# Altium schematic sheet connectors.SchDoc: Connectors
size A4; Organization: Badgerloop Electrical; Address1: 133 Engineering Research Building; Address2: 1500 Engineering Drive; Address3: Madison, Wi 53706; SheetNumber: 2
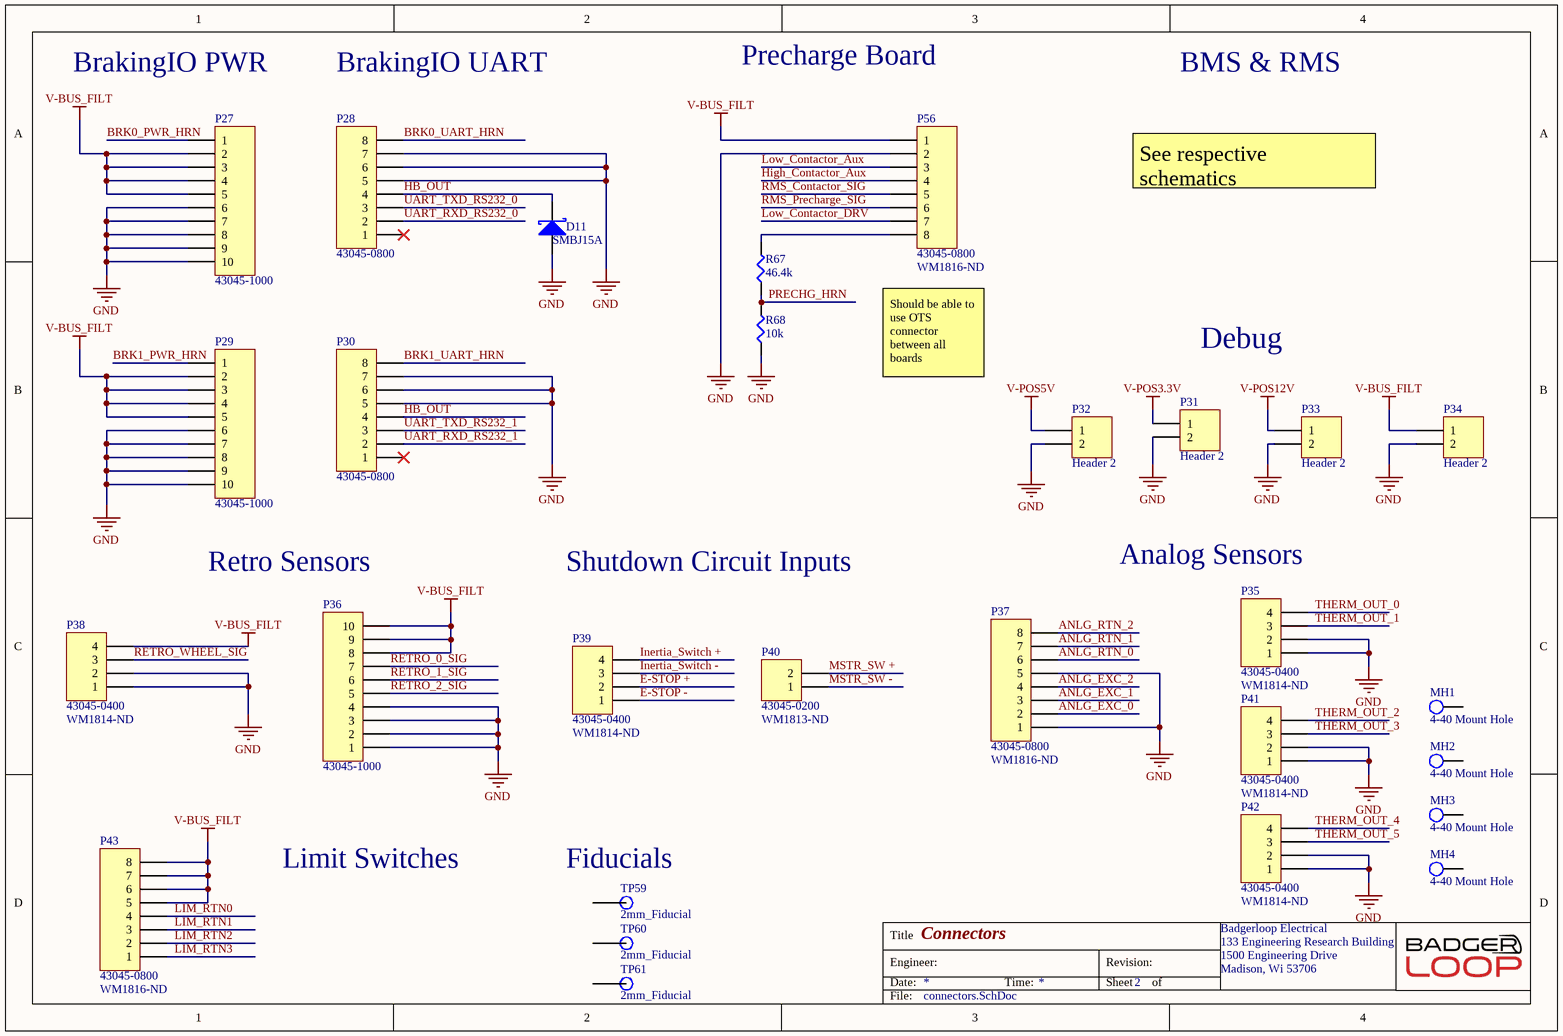
[diagram p0: connectors.SchDoc]

## Parts
D11  SMBJ15A  [DIOM4436X26N]
MH1  4-40 Mount Hole  [MH]
MH2  4-40 Mount Hole  [MH]
MH3  4-40 Mount Hole  [MH]
MH4  4-40 Mount Hole  [MH]
P27  43045-1000  [430451000]
P28  43045-0800  [430450800]
P29  43045-1000  [430451000]
P30  43045-0800  [430450800]
P31  Header 2  [Pin Header 1x2 TH Pitch 2.54mm]
P32  Header 2  [Pin Header 1x2 TH Pitch 2.54mm]
P33  Header 2  [Pin Header 1x2 TH Pitch 2.54mm]
P34  Header 2  [Pin Header 1x2 TH Pitch 2.54mm]
P35  43045-0400  Supplier Part Number 1: WM1814-ND  [430450400]
P36  43045-1000  [430451000]
P37  43045-0800  Supplier Part Number 1: WM1816-ND  [430450800]
P38  43045-0400  Supplier Part Number 1: WM1814-ND  [430450400]
P39  43045-0400  Supplier Part Number 1: WM1814-ND  [430450400]
P40  43045-0200  Supplier Part Number 1: WM1813-ND  [430450200]
P41  43045-0400  Supplier Part Number 1: WM1814-ND  [430450400]
P42  43045-0400  Supplier Part Number 1: WM1814-ND  [430450400]
P43  43045-0800  Supplier Part Number 1: WM1816-ND  [430450800]
P56  43045-0800  Supplier Part Number 1: WM1816-ND  [430450800]
R67  46.4k  [SMD-1206-RES]
R68  10k  [SMD-0805-RES]
TP59  2mm_Fiducial  [2mm_Fiducial]
TP60  2mm_Fiducial  [2mm_Fiducial]
TP61  2mm_Fiducial  [2mm_Fiducial]

## Nets
GND: D11.2(K) P27.6 P27.7 P27.8 P27.9 P27.10 P28.5 P28.6 P28.7 P29.6 P29.7 P29.8 P29.9 P29.10 P30.5 P30.6 P30.7 P31.2 P32.2 P33.2 P34.2 P35.1 P35.2 P36.1 P36.2 P36.3 P36.4 P37.1 P37.5 P38.1 P38.2 P41.1 P41.2 P42.1 P42.2 P56.2 R68.1
V-BUS_FILT: P27.2 P27.3 P27.4 P27.5 P29.2 P29.3 P29.4 P29.5 P34.1 P36.8 P36.9 P36.10 P38.4 P43.5 P43.6 P43.7 P43.8 P56.1
V-POS3.3V: P31.1
V-POS5V: P32.1
V-POS12V: P33.1
ANLG_EXC_0: P37.2
ANLG_EXC_1: P37.3
ANLG_EXC_2: P37.4
ANLG_RTN_0: P37.6
ANLG_RTN_1: P37.7
ANLG_RTN_2: P37.8
BRK0_PWR_HRN: P27.1
BRK0_UART_HRN: P28.8
BRK1_PWR_HRN: P29.1
BRK1_UART_HRN: P30.8
E-STOP +: P39.2
E-STOP -: P39.1
HB_OUT: D11.1(A) P28.4 P30.4
High_Contactor_Aux: P56.4
Inertia_Switch +: P39.4
Inertia_Switch -: P39.3
LIM_RTN0: P43.4
LIM_RTN1: P43.3
LIM_RTN2: P43.2
LIM_RTN3: P43.1
Low_Contactor_Aux: P56.3
Low_Contactor_DRV: P56.7
MSTR_SW +: P40.2
MSTR_SW -: P40.1
PRECHG_HRN: R67.1 R68.2
RETRO_0_SIG: P36.7
RETRO_1_SIG: P36.6
RETRO_2_SIG: P36.5
RETRO_WHEEL_SIG: P38.3
RMS_Contactor_SIG: P56.5
RMS_Precharge_SIG: P56.6
THERM_OUT_0: P35.4
THERM_OUT_1: P35.3
THERM_OUT_2: P41.4
THERM_OUT_3: P41.3
THERM_OUT_4: P42.4
THERM_OUT_5: P42.3
UART_RXD_RS232_0: P28.2
UART_RXD_RS232_1: P30.2
UART_TXD_RS232_0: P28.3
UART_TXD_RS232_1: P30.3
NetP56_8: P56.8 R67.2

Not connected (* = marked no-connect by the designer): MH1 46; MH2 46; MH3 46; MH4 46; P28 1*; P30 1*; TP59 1; TP60 1; TP61 1

## Notes on the sheet
- BrakingIO PWR
- BrakingIO UART
- Precharge Board
- BMS & RMS
- See respective schematics
- Should be able to use OTS connector between all boards
- Debug
- Retro Sensors
- Shutdown Circuit Inputs
- (near P35) Analog Sensors
- Limit Switches
- (near TP59) Fiducials
- Title
- Engineer:
- Date:
- Time:
- Revision:
- Sheet
- of
- File:

## Library data of the parts
D11 = SMBJ15A: TVS DIODE 15V 24.4V DO214AA; Manufacturer: Littelfuse; Direction: Unidirectional; Min Breakdown Voltage: 16.7V; Peak Pulse Power: 600W; Peak Pulse Current: 24.6A; Test Current: 1mA; Number of Elements: 1; Power Line Protection: No; Max Breakdown Voltage: 18.5V; Max Reverse Leakage Current: 1uA; Max Power Dissipation: 5W; Element Configuration: Single; ESD Protection: Yes; Current: 68A; Voltage: 5V; Supplier 1: Digi-Key; Stock 1: 73945; Pricing 1: 1=0.45000, 10=0.33900, 25=0.30520, 100=0.21090, 250=0.17760, 500=0.14430, 1000=0.11100 (USD); RoHS: Yes; Mount: Surface Mount; Case/Package: SMB; Number of Pins: 2; Min Operating Temperature: -65°C; Max Operating Temperature: 150°C; Packaging: Tape and Reel; Reverse Standoff Voltage: 15V; Clamping Voltage: 24.4V; Power Dissipation: 600W; Voltage Rating (DC): 15V; Reverse Breakdown Voltage: 16.7V; Package Quantity: 3000; Operating Supply Voltage: 15V; Max Surge Current: 24.6A; Number of Unidirectional Channels: 1; Breakdown Voltage: 16.7V; Number of Channels: 1; Polarity: Unidirectional; Termination: SMD/SMT; Leakage Current: 1uA; Composition: Zener; Length: 4.57mm; Height: 2.237mm; Width: 3.94mm; Radiation Hardening: No; Lead Free: Lead Free; REACH SVHC: Unknown; ComponentLink1URL: https://datasheet.ciiva.com/34301/1078555-34301957.pdf?src-supplier=Jameco; ComponentLink1Description: https://datasheet.ciiva.com/34301/1078555-34301957.pdf?src-supplier=Jameco; ComponentLink2URL: https://datasheet.ciiva.com/25624/0900766b810f4eeb-25624826.pdf?src-supplier=RSComponents; ComponentLink2Description: https://datasheet.ciiva.com/25624/0900766b810f4eeb-25624826.pdf?src-supplier=RSComponents; ComponentLink3URL: https://datasheet.ciiva.com/46385/13057-46385079.pdf?src-supplier=Element14; ComponentLink3Description: https://datasheet.ciiva.com/46385/13057-46385079.pdf?src-supplier=Element14; ComponentLink4URL: https://datasheet.ciiva.com/331/littelfuse-tvs-diode-smbj-datasheet-pdf-331176.pdf?src-supplier=Digi-Key; ComponentLink4Description: https://datasheet.ciiva.com/331/littelfuse-tvs-diode-smbj-datasheet-pdf-331176.pdf?src-supplier=Digi-Key; ComponentLink5URL: https://datasheet.ciiva.com/331/littelfuse-tvs-diode-smbj-datasheet-pdf-331177.pdf?src-supplier=Digi-Key; ComponentLink5Description: https://datasheet.ciiva.com/331/littelfuse-tvs-diode-smbj-datasheet-pdf-331177.pdf?src-supplier=Digi-Key; ComponentLink6URL: https://datasheet.ciiva.com/331/littelfuse-tvs-diode-smbj-datasheet-pdf-331178.pdf?src-supplier=Digi-Key; ComponentLink6Description: https://datasheet.ciiva.com/331/littelfuse-tvs-diode-smbj-datasheet-pdf-331178.pdf?src-supplier=Digi-Key; Supplier 2: Digi-Key; Stock 2: 69911; Pricing 2: 1=0.35000, 10=0.28700, 25=0.26240, 100=0.19540, 250=0.17704, 500=0.14652, 1000=0.10989 (USD); ComponentLink7URL: https://datasheet.ciiva.com/25624/0900766b810f4eeb-25624712.pdf?src-supplier=RSComponents; ComponentLink7Description: https://datasheet.ciiva.com/25624/0900766b810f4eeb-25624712.pdf?src-supplier=RSComponents; ComponentLink8URL: https://datasheet.ciiva.com/34302/1546929-34302459.pdf?src-supplier=Jameco; ComponentLink8Description: https://datasheet.ciiva.com/34302/1546929-34302459.pdf?src-supplier=Jameco; ComponentLink9URL: https://datasheet.ciiva.com/46381/1677318-46381958.pdf?src-supplier=Element14; ComponentLink9Description: https://datasheet.ciiva.com/46381/1677318-46381958.pdf?src-supplier=Element14; ComponentLink10URL: https://datasheet.ciiva.com/331/littelfuse-tvs-diode-smbj-datasheet-pdf-331131.pdf?src-supplier=Digi-Key; ComponentLink10Description: https://datasheet.ciiva.com/331/littelfuse-tvs-diode-smbj-datasheet-pdf-331131.pdf?src-supplier=Digi-Key; ComponentLink11URL: https://datasheet.ciiva.com/331/littelfuse-tvs-diode-smbj-datasheet-pdf-331132.pdf?src-supplier=Digi-Key; ComponentLink11Description: https://datasheet.ciiva.com/331/littelfuse-tvs-diode-smbj-datasheet-pdf-331132.pdf?src-supplier=Digi-Key; ComponentLink12URL: https://datasheet.ciiva.com/331/littelfuse-tvs-diode-smbj-datasheet-pdf-331133.pdf?src-supplier=Digi-Key; ComponentLink12Description: https://datasheet.ciiva.com/331/littelfuse-tvs-diode-smbj-datasheet-pdf-331133.pdf?src-supplier=Digi-Key; Supplier Part Number 2: SMBJ5.0ALFCT-ND; Supplier Part Number 1: SMBJ15ALFCT-ND
P27 P29 P36 = 43045-1000: GLOVE, POLYAMIDE, L/FREE, PU, SIZE 6 - More Details; Manufacturer: Molex; Connector Type: Power,Rectangular; Number of Positions: 10; Contact Resistance: 10mR; Gender: Male; Current Rating: 5A; Voltage Rating: 250V; Max Voltage Rating (DC): 250.25kV; Insulation Resistance: 1GR; Pitch: 3mm; Approvals: UL,CSA,TUV; Glow Wire Compliant: Compliant; Supplier 1: Digi-Key; Manufacturer Part Number: 43045-1000; Stock 1: 4799; Pricing 1: 1=2.57000, 10=2.33100, 100=1.99790, 500=1.66496, 1000=1.42710, 5000=1.26536 (USD); RoHS: Yes; Mount: Through Hole,PCB; Contact Plating: Tin; Color: Black; Contact Material: Brass,Tin; Housing Color: Black; Housing Material: Thermoplastic; Material: Polyester; Min Operating Temperature: -40°C; Max Operating Temperature: 105°C; Number of Rows: 2; Termination: Solder; Packaging: Tray; Number of Contacts: 10; Package Quantity: 1224; Orientation: Right Angle; Max Current Rating: 5A; Number of Poles: 10; Voltage Rating (AC): 250V; Number of Circuits: 10; Working Voltage: 250V; Voltage Rating (DC): 250V; Diameter: 3mm; Length: 19.15mm; Height: 8.77mm; Row Spacing: 3mm; Depth: 12.2mm; Radiation Hardening: No; Lead Free: Lead Free; Flammability Rating: UL94 V-0; REACH SVHC: Unknown; Halogen Free: Low Halogen; ComponentLink1URL: https://datasheet.ciiva.com/5150/0430451000-pcb-headers-143006-5150145.pdf?src-supplier=Mouser; ComponentLink1Description: https://datasheet.ciiva.com/5150/0430451000-pcb-headers-143006-5150145.pdf?src-supplier=Mouser; ComponentLink2URL: https://datasheet.ciiva.com/11749/0900766b80027348-11749233.pdf?src-supplier=RSComponents; ComponentLink2Description: https://datasheet.ciiva.com/11749/0900766b80027348-11749233.pdf?src-supplier=RSComponents; ComponentLink3URL: https://datasheet.ciiva.com/19461/883595-19461109.pdf?src-supplier=Jameco; ComponentLink3Description: https://datasheet.ciiva.com/19461/883595-19461109.pdf?src-supplier=Jameco; ComponentLink4URL: https://datasheet.ciiva.com/30068/153980430451000-pcb-headers-30068060.pdf?src-supplier=Onlinecomponents.com; ComponentLink4Description: https://datasheet.ciiva.com/30068/153980430451000-pcb-headers-30068060.pdf?src-supplier=Onlinecomponents.com; ComponentLink5URL: https://datasheet.ciiva.com/14155/04402310-14155207.pdf?src-supplier=Distrelec; ComponentLink5Description: https://datasheet.ciiva.com/14155/04402310-14155207.pdf?src-supplier=Distrelec; ComponentLink6URL: https://datasheet.ciiva.com/18454/70090797-18454139.pdf?src-supplier=Allied+Electronics; ComponentLink6Description: https://datasheet.ciiva.com/18454/70090797-18454139.pdf?src-supplier=Allied+Electronics; ComponentLink7URL: https://datasheet.ciiva.com/16658/0430451000-pcb-headers-16658413.pdf?src-supplier=Avnet+Europe; ComponentLink7Description: https://datasheet.ciiva.com/16658/0430451000-pcb-headers-16658413.pdf?src-supplier=Avnet+Europe; ComponentLink8URL: https://datasheet.ciiva.com/9468/0430451000-pcb-headers-9468495.pdf?src-supplier=Avnet; ComponentLink8Description: https://datasheet.ciiva.com/9468/0430451000-pcb-headers-9468495.pdf?src-supplier=Avnet; Supplier Part Number 1: WM1817-ND
P28 P30 P37 P43 P56 = 43045-0800: CONN HEADER R/A 8POS 3MM; Manufacturer: Molex; Number of Contacts: 8; Contact Resistance: 10mR; Max Voltage Rating (DC): 250.25kV; Current Rating: 5A; Voltage Rating (AC): 250V; Voltage Rating: 600V; Gender: Male; Insulation Resistance: 1GR; Approvals: UL,CSA,TUV; Glow Wire Compliant: Compliant; Supplier 1: Digi-Key; Manufacturer Part Number: 43045-0800; Stock 1: 2632; Pricing 1: 1=1.91000, 10=1.73100, 100=1.48390, 500=1.23656, 1000=1.05990, 5000=0.93978, 10000=0.91858 (USD); RoHS: Yes; Mount: Through Hole; Case/Package: SMC; Contact Plating: Tin; Contact Material: Brass,Tin; Color: Black; Housing Color: Black; Housing Material: Thermoplastic; Material: Polyester; Min Operating Temperature: -40°C; Max Operating Temperature: 105°C; Number of Rows: 2; Termination: Solder; Packaging: Tray; Number of Positions: 8; Orientation: Right Angle; Number of Poles: 8; Package Quantity: 1440; Max Current Rating: 5A; Number of Circuits: 8; Working Voltage: 250V; Voltage Rating (DC): 250V; Diameter: 3mm; Length: 16.15mm; Height: 8.77mm; Pitch: 3mm; Row Spacing: 3mm; Depth: 12.2mm; Radiation Hardening: No; Flammability Rating: UL94 V-0; REACH SVHC: Unknown; Halogen Free: Low Halogen; Lead Free: Lead Free; ComponentLink1URL: https://datasheet.ciiva.com/5158/0430450800-pcb-headers-142625-5158817.pdf?src-supplier=Mouser; ComponentLink1Description: https://datasheet.ciiva.com/5158/0430450800-pcb-headers-142625-5158817.pdf?src-supplier=Mouser; ComponentLink2URL: https://datasheet.ciiva.com/7683/27645-7683683.pdf?src-supplier=Element14; ComponentLink2Description: https://datasheet.ciiva.com/7683/27645-7683683.pdf?src-supplier=Element14; ComponentLink3URL: https://datasheet.ciiva.com/19462/883536-19462164.pdf?src-supplier=Jameco; ComponentLink3Description: https://datasheet.ciiva.com/19462/883536-19462164.pdf?src-supplier=Jameco; ComponentLink4URL: https://datasheet.ciiva.com/11751/0900766b80027348-11751142.pdf?src-supplier=RSComponents; ComponentLink4Description: https://datasheet.ciiva.com/11751/0900766b80027348-11751142.pdf?src-supplier=RSComponents; ComponentLink5URL: https://datasheet.ciiva.com/30198/267770430450800-pcb-headers-30198875.pdf?src-supplier=Onlinecomponents.com; ComponentLink5Description: https://datasheet.ciiva.com/30198/267770430450800-pcb-headers-30198875.pdf?src-supplier=Onlinecomponents.com; ComponentLink6URL: https://datasheet.ciiva.com/1443/1850016-1443537.pdf?src-supplier=Element14; ComponentLink6Description: https://datasheet.ciiva.com/1443/1850016-1443537.pdf?src-supplier=Element14; ComponentLink7URL: https://datasheet.ciiva.com/14155/04402310-14155206.pdf?src-supplier=Distrelec; ComponentLink7Description: https://datasheet.ciiva.com/14155/04402310-14155206.pdf?src-supplier=Distrelec; ComponentLink8URL: https://datasheet.ciiva.com/16657/0430450800-pcb-headers-16657964.pdf?src-supplier=Avnet+Europe; ComponentLink8Description: https://datasheet.ciiva.com/16657/0430450800-pcb-headers-16657964.pdf?src-supplier=Avnet+Europe; ComponentLink9URL: https://datasheet.ciiva.com/10087/0430450800-pcb-headers-10087853.pdf?src-supplier=Avnet; ComponentLink9Description: https://datasheet.ciiva.com/10087/0430450800-pcb-headers-10087853.pdf?src-supplier=Avnet
  P28 P30: Supplier Part Number 1: WM1816-ND
P31-P34 = Header 2: Header, 2-Pin; LatestRevisionDate: 17-Jul-2002; LatestRevisionNote: Re-released for DXP Platform.; Publisher: Altium Limited
P35 P38 P39 P41 P42 = 43045-0400: Male connector dual row 90° 3 mm Pole no. 2x2 Micro-Fit, 43045-0400, Molex; Contact Resistance: 10mR; Number of Contacts: 4; Max Voltage Rating (AC): 250V; Connector Type: Male Pin; Pitch: 3mm; Row Spacing: 0.118inch; Supplier 1: Digi-Key; Manufacturer: Molex; Manufacturer Part Number: 43045-0400; Stock 1: 5904; Pricing 1: 1=1.33000, 10=1.16700, 100=1.00670, 500=0.82368, 1000=0.73216, 5000=0.64064, 10000=0.60861 (USD); RoHS: Yes; Mount: Through Hole; Contact Plating: Tin; Color: Black; Contact Material: Brass; Housing Color: Black; Housing Material: Polymer; Min Operating Temperature: -40°C; Max Operating Temperature: 105°C; Number of Rows: 2; Termination: Solder; Packaging: Tray; Fastening Type: Ramp; Number of Positions: 4; Orientation: Right Angle; Length: 10.15mm; Depth: 12.2mm; Flammability Rating: UL94 V-0; ComponentLink1URL: https://datasheet.ciiva.com/712/430450200-sd-712017.pdf?src-supplier=Digi-Key; ComponentLink1Description: https://datasheet.ciiva.com/712/430450200-sd-712017.pdf?src-supplier=Digi-Key; ComponentLink2URL: https://datasheet.ciiva.com/20209/22-3744e-20209522.pdf?src-supplier=Rapid+Electronics; ComponentLink2Description: https://datasheet.ciiva.com/20209/22-3744e-20209522.pdf?src-supplier=Rapid+Electronics; ComponentLink3URL: https://datasheet.ciiva.com/11746/0900766b80027348-11746988.pdf?src-supplier=RSComponents; ComponentLink3Description: https://datasheet.ciiva.com/11746/0900766b80027348-11746988.pdf?src-supplier=RSComponents; ComponentLink4URL: https://datasheet.ciiva.com/30193/145420430450400-pcb-headers-30193310.pdf?src-supplier=Onlinecomponents.com; ComponentLink4Description: https://datasheet.ciiva.com/30193/145420430450400-pcb-headers-30193310.pdf?src-supplier=Onlinecomponents.com
P40 = 43045-0200: CONN HEADER R/A 2POS; Manufacturer: Molex; Contact Resistance: 10mR; Number of Contacts: 2; Voltage Rating: 600V; Current Rating: 5A; Gender: Male; Max Voltage Rating (DC): 250.25kV; Voltage Rating (DC): 250V; Insulation Resistance: 1GR; Pitch: 3mm; Glow Wire Compliant: Compliant; Approvals: UL,CSA,TUV; Supplier 1: Digi-Key; Manufacturer Part Number: 43045-0200; Stock 1: 6320; Pricing 1: 1=0.97000, 10=0.84900, 100=0.73280, 500=0.59958, 1000=0.53296, 5000=0.46634, 10000=0.44302 (USD); RoHS: Yes; Mount: Through Hole; Case/Package: SMC; Contact Plating: Tin; Color: Black; Contact Material: Brass,Tin; Housing Color: Black; Housing Material: Thermoplastic; Material: Thermoplastic; Min Operating Temperature: -40°C; Max Operating Temperature: 105°C; Termination: Through Hole; Number of Rows: 2; Orientation: Right Angle; Packaging: Tray; Number of Positions: 2; Package Quantity: 3168; Number of Circuits: 2; Contact Gender: Male; Diameter: 3mm; Row Spacing: 3mm; Radiation Hardening: No; Flammability Rating: UL94 V-0; REACH SVHC: Unknown; Lead Free: Lead Free; Halogen Free: Low Halogen; ComponentLink1URL: https://datasheet.ciiva.com/14155/04402310-14155203.pdf?src-supplier=Distrelec; ComponentLink1Description: https://datasheet.ciiva.com/14155/04402310-14155203.pdf?src-supplier=Distrelec; ComponentLink2URL: https://datasheet.ciiva.com/19454/883270-19454006.pdf?src-supplier=Jameco; ComponentLink2Description: https://datasheet.ciiva.com/19454/883270-19454006.pdf?src-supplier=Jameco; ComponentLink3URL: https://datasheet.ciiva.com/5150/0430450200-pcb-headers-145770-5150407.pdf?src-supplier=Mouser; ComponentLink3Description: https://datasheet.ciiva.com/5150/0430450200-pcb-headers-145770-5150407.pdf?src-supplier=Mouser; ComponentLink4URL: https://datasheet.ciiva.com/11747/0900766b80027348-11747001.pdf?src-supplier=RSComponents; ComponentLink4Description: https://datasheet.ciiva.com/11747/0900766b80027348-11747001.pdf?src-supplier=RSComponents; ComponentLink5URL: https://datasheet.ciiva.com/16656/0430450200-pcb-headers-16656330.pdf?src-supplier=Avnet+Europe; ComponentLink5Description: https://datasheet.ciiva.com/16656/0430450200-pcb-headers-16656330.pdf?src-supplier=Avnet+Europe; ComponentLink6URL: https://datasheet.ciiva.com/10090/0430450200-pcb-headers-10090299.pdf?src-supplier=Avnet; ComponentLink6Description: https://datasheet.ciiva.com/10090/0430450200-pcb-headers-10090299.pdf?src-supplier=Avnet; ComponentLink7URL: https://datasheet.ciiva.com/36854/124280430450200-pcb-headers-36854331.pdf?src-supplier=Onlinecomponents.com; ComponentLink7Description: https://datasheet.ciiva.com/36854/124280430450200-pcb-headers-36854331.pdf?src-supplier=Onlinecomponents.com; ComponentLink8URL: https://datasheet.ciiva.com/1443/1859921-1443437.pdf?src-supplier=Element14; ComponentLink8Description: https://datasheet.ciiva.com/1443/1859921-1443437.pdf?src-supplier=Element14
R67 = ERJ-8ENF4642V: RES SMD 46.4K OHM 1% 1/4W 1206; Manufacturer: Panasonic Electronic Components; Factory Stock: 0; Unit Price (USD): 0.00933; @ qty: 1500; Minimum Quantity: 1; Power (Watts): 0.25W, 1/4W; Temperature Coefficient: ±100ppm/°C; Part Number: ERJ-8ENF4642V; Datasheets: http://industrial.panasonic.com/www-cgi/jvcr13pz.cgi?E+PZ+3+AOA0002+ERJ8ENF4642V+7+WW; Image: //media.digikey.com/Renders/Panasonic%20Renders/ERJ-1206%20Pkg.jpg; Digi-Key Part Number: P46.4KFCT-ND; Quantity Available: 23527; Packaging: Cut Tape (CT); Series: ERJ; Part Status: Active; Value: 46.4k; Tolerance: ±1%; Composition: Thick Film; Features: Automotive AEC-Q200; Operating Temperature: -55°C ~ 155°C; Package / Case: 1206 (3216 Metric); Supplier Device Package: 1206; Size / Dimension: 0.126" L x 0.063" W (3.20mm x 1.60mm); Height - Seated (Max): 0.028" (0.70mm); Number of Terminations: 2; Failure Rate: -
R68 = ERJ-P06J103V: RES SMD 10K OHM 5% 1/2W 0805; Manufacturer: Panasonic Electronic Components; Factory Stock: 0; Unit Price (USD): 0.01839; @ qty: 1500; Minimum Quantity: 1; Power (Watts): 0.5W, 1/2W; Temperature Coefficient: ±200ppm/°C; Part Number: ERJ-P06J103V; Datasheets: https://industrial.panasonic.com/cdbs/www-data/pdf/RDA0000/AOA0000C243.pdf; Image: //media.digikey.com/Renders/Panasonic%20Renders/ERJ-0805%20Pkg.jpg; Digi-Key Part Number: P10KADCT-ND; Quantity Available: 413576; Packaging: Cut Tape (CT); Series: ERJ; Part Status: Active; Value: 10k; Tolerance: ±5%; Composition: Thick Film; Features: Automotive AEC-Q200, Pulse Withstanding; Operating Temperature: -55°C ~ 155°C; Package / Case: 0805 (2012 Metric); Supplier Device Package: 0805; Size / Dimension: 0.079" L x 0.049" W (2.00mm x 1.25mm); Height - Seated (Max): 0.028" (0.70mm); Number of Terminations: 2; Failure Rate: -
TP59-TP61 = 2mm_Fiducial: Fiducial 2mm